# Altium schematic sheet 2 main mcu.SchDoc
size A4; DocumentNumber: 2; SheetNumber: 4; SheetTotal: 9
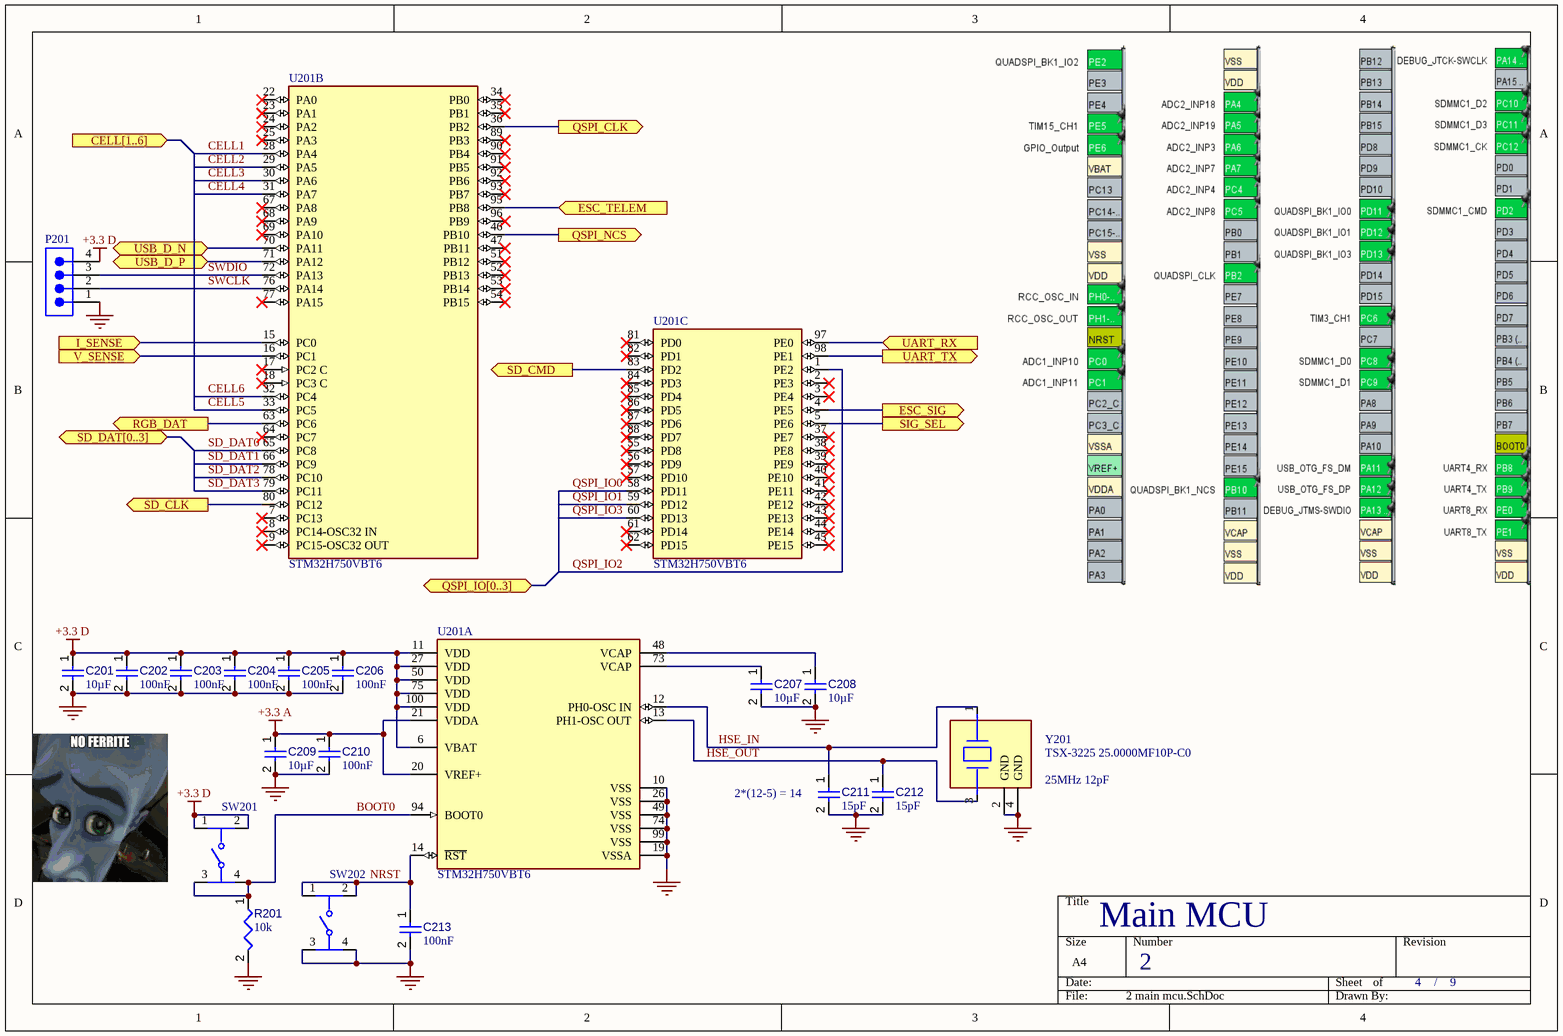
[diagram p0: 2 main mcu.SchDoc]

## Parts
C201  value 10µF  [CAPC0603(1608)100_L]  (hidden comment: Capacitor 10µF +/-20% 10V 0603)
C202  value 100nF  [CAPC0402(1005)60_L]  (hidden comment: Capacitor 100nF +/-20% 25V 0402)
C203  value 100nF  [CAPC0402(1005)60_L]  (hidden comment: Capacitor 100nF +/-20% 25V 0402)
C204  value 100nF  [CAPC0402(1005)60_L]  (hidden comment: Capacitor 100nF +/-20% 25V 0402)
C205  value 100nF  [CAPC0402(1005)60_L]  (hidden comment: Capacitor 100nF +/-20% 25V 0402)
C206  value 100nF  [CAPC0402(1005)60_L]  (hidden comment: Capacitor 100nF +/-20% 25V 0402)
C207  value 10µF  [CAPC0603(1608)100_L]  (hidden comment: Capacitor 10µF +/-20% 10V 0603)
C208  value 10µF  [CAPC0603(1608)100_L]  (hidden comment: Capacitor 10µF +/-20% 10V 0603)
C209  value 10µF  [CAPC0603(1608)100_L]  (hidden comment: Capacitor 10µF +/-20% 10V 0603)
C210  value 100nF  [CAPC0402(1005)60_L]  (hidden comment: Capacitor 100nF +/-20% 25V 0402)
C211  value 15pF  [CAPC0402(1005)60_L]  (hidden comment: Capacitor 15pF +/-20% 50V 0402)
C212  value 15pF  [CAPC0402(1005)60_L]  (hidden comment: Capacitor 15pF +/-20% 50V 0402)
C213  value 100nF  [CAPC0402(1005)60_L]  (hidden comment: Capacitor 100nF +/-20% 25V 0402)
P201  61300411121  [61300411121]  (value not drawn)
R201  value 10k  [RESC0402(1005)_L]  (hidden comment: Resistor 10K  +/-1 % 0402 63 mW)
SW201  PTS810SJM250SMTRLFS  [FP-PTS810SJM250SMTRLFS-MFG]  (value not drawn)
SW202  PTS810SJM250SMTRLFS  [FP-PTS810SJM250SMTRLFS-MFG]  (value not drawn)
U201  STM32H750VBT6  [FP-LQFP100-1L-MFG]  (parts A,B,C of 3)
Y201  TSX-3225 25.0000MF10P-C0  [FP-TSX-3225-MFG]

## Ports
CELL[1..6] (in), ESC_SIG (out), ESC_TELEM (in), I_SENSE (in), QSPI_CLK (out), QSPI_IO[0..3] (bidir), QSPI_NCS (out), RGB_DAT (out), SD_CLK (out), SD_CMD (out), SD_DAT[0..3] (bidir), SIG_SEL (out), UART_RX (in), UART_TX (out), USB_D_N (bidir), USB_D_P (bidir), V_SENSE (in)

## Nets
+3.3 A: C209.1 C210.1 U201.20(VREF+) U201.21(VDDA)
+3.3 D: C201.1 C202.1 C203.1 C204.1 C205.1 C206.1 P201.4 SW201.1 SW201.2 U201.6(VBAT) U201.11(VDD) U201.27(VDD) U201.50(VDD) U201.75(VDD) U201.100(VDD)
GND: C201.2 C202.2 C203.2 C204.2 C205.2 C206.2 C207.2 C208.2 C209.2 C210.2 C211.2 C212.2 C213.2 P201.1 R201.2 SW202.3 SW202.4 U201.10(VSS) U201.19(VSSA) U201.26(VSS) U201.49(VSS) U201.74(VSS) U201.99(VSS) Y201.2(GND) Y201.4(GND)
BOOT0: R201.1 SW201.3 SW201.4 U201.94(BOOT0)
CELL1: U201.28(PA4)
CELL2: U201.29(PA5)
CELL3: U201.30(PA6)
CELL4: U201.31(PA7)
CELL5: U201.33(PC5)
CELL6: U201.32(PC4)
ESC_SIG: U201.4(PE5) ; port ESC_SIG
ESC_TELEM: U201.95(PB8) ; port ESC_TELEM
HSE_IN: C211.1 U201.12(PH0-OSC_IN) Y201.1
HSE_OUT: C212.1 U201.13(PH1-OSC_OUT) Y201.3
I_SENSE: U201.15(PC0) ; port I_SENSE
NRST: C213.1 SW202.1 SW202.2 U201.14(~{RST})
QSPI_CLK: U201.36(PB2) ; port QSPI_CLK
QSPI_IO0: U201.58(PD11)
QSPI_IO1: U201.59(PD12)
QSPI_IO2: U201.1(PE2)
QSPI_IO3: U201.60(PD13)
QSPI_NCS: U201.46(PB10) ; port QSPI_NCS
RGB_DAT: U201.63(PC6) ; port RGB_DAT
SD_CLK: U201.80(PC12) ; port SD_CLK
SD_CMD: U201.83(PD2) ; port SD_CMD
SD_DAT0: U201.65(PC8)
SD_DAT1: U201.66(PC9)
SD_DAT2: U201.78(PC10)
SD_DAT3: U201.79(PC11)
SIG_SEL: U201.5(PE6) ; port SIG_SEL
SWCLK: P201.2 U201.76(PA14)
SWDIO: P201.3 U201.72(PA13)
UART_RX: U201.97(PE0) ; port UART_RX
UART_TX: U201.98(PE1) ; port UART_TX
USB_D_N: U201.70(PA11) ; port USB_D_N
USB_D_P: U201.71(PA12) ; port USB_D_P
V_SENSE: U201.16(PC1) ; port V_SENSE
NetC207_1: C207.1 U201.73(VCAP)
NetC208_1: C208.1 U201.48(VCAP)

Not connected (* = marked no-connect by the designer): U201 2(PE3)* 3(PE4)* 7(PC13)* 8(PC14-OSC32_IN)* 9(PC15-OSC32_OUT)* 17(PC2_C)* 18(PC3_C)* 22(PA0)* 23(PA1)* 24(PA2)* 25(PA3)* 34(PB0)* 35(PB1)* 37(PE7)* 38(PE8)* 39(PE9)* 40(PE10)* 41(PE11)* 42(PE12)* 43(PE13)* 44(PE14)* 45(PE15)* 47(PB11)* 51(PB12)* 52(PB13)* 53(PB14)* 54(PB15)* 55(PD8)* 56(PD9)* 57(PD10)* 61(PD14)* 62(PD15)* 64(PC7)* 67(PA8)* 68(PA9)* 69(PA10)* 77(PA15)* 81(PD0)* 82(PD1)* 84(PD3)* 85(PD4)* 86(PD5)* 87(PD6)* 88(PD7)* 89(PB3)* 90(PB4)* 91(PB5)* 92(PB6)* 93(PB7)* 96(PB9)*

## Notes on the sheet
- (near Y201) 25MHz 12pF
- (near C211) 2*(12-5) = 14
- Main MCU
- /

## Library data of the parts
C201 C207-C209 = CMP-001-00075-4: Chip Capacitor, 10µF +/-20%, 10V, 0603, Thickness 1 mm; Tolerance: 10%; Voltage Rating: 10V; Max Operating Temperature: 85°C; Pins: 2; Case/Package: 0603; Mounting Technology: SMT; Min Operating Temperature: -55°C
C202-C206 C210 C213 = CMP-001-00065-4: Chip Capacitor, 100nF +/-20%, 25V, 0402, Thickness 0.6 mm; Tolerance: 10%; Max Operating Temperature: 85°C; Min Operating Temperature: -55°C; Pins: 2; Voltage Rating: 25V; Mounting Technology: SMT; Case/Package: 0402
C211 C212 = CMP-001-00069-3: Chip Capacitor, 15pF +/-20%, 50V, 0402, Thickness 0.6 mm; Tolerance: 5%; Max Operating Temperature: 85°C; Pins: 2; Case/Package: 0402; Voltage Rating: 50V; Min Operating Temperature: -55°C; Mounting Technology: SMT; JLCPCB Part #: C1548
P201 = CMP-1502-01064-3: NexarPartId: 32855522; Operating Supply Voltage: 250V; Pitch: 2.54mm; Contact Resistance: 20mΩ; Number of Positions: 4; Current Rating: 3A; Connector Type: Male Pin; Gender: Male; Contact Plating: Gold; Height: 8.89mm; Lead Pitch: 2.54mm; Lead Free: Lead Free; Contact Mating Length: 5.9944mm; Number of Rows: 1; Termination: Solder; Packaging: Bulk; REACH SVHC: Unknown; Min Operating Temperature: -40°C; RoHS: Compliant; Number of Contacts: 4; Voltage Rating: 250V; Color: Black; Max Operating Temperature: 105°C; Contact Material: Copper; Mount: Through Hole; Orientation: Vertical; Number of Pins: 4
R201 = CMP-009-00149-3: Chip Resistor, 10 kOhms, +/-1 %, 63 mW, -55 to 125 degC, 0402; Power: 63mW; Tolerance: 1%; Min Operating Temperature: -55°C; Case/Package: 0402; Max Operating Temperature: 155°C; Pins: 2
SW201 SW202 = CMP-10040-000001-2: SWITCH TACTILE SPST-NO 0.05A 16V; Throw Configuration: SPST; Operating Force: 160gf; Actuator Type: Standard; Switch Travel: 0.15mm; Switch Function: Off-Mom; Max Current Rating: 50mA; Mechanical Life: 150000Cycles; Illumination Type: Non-Illuminated; Package Quantity: 2900; Depth: 4.6mm; Mount: Surface Mount; Packaging: Tape and Reel; Length: 3.2mm; RoHS Compliant: Yes; Case/Package: SMD/SMT; Voltage Rating (DC): 16V; Min Operating Temperature: -40°C; Termination: J-Bend; Lead Free: Lead Free; Contact Plating: Silver; Orientation: Straight; Max Operating Temperature: 85°C; Current Rating: 50mA; Color: Black
U201 = CMP-12105-000017-1: IC MCU 32BIT 128KB FLASH 100LQFP; Manufacturer: STMicroelectronics; Number Of Uart Channels: 9; Number Of I/Os: 82; Max Junction Temp: +125°C; Data Bus Width: 32bits; Ram Size: 1MBytes; Min Supply Voltage: 1.62V; Number Of Spi Channels: 6; Number Of Adc Channels: 36; Max Supply Voltage: 3.6V; Standoff Height: 0.05mm; Interface: I2C,SPI,UART,USART,CAN,USB,LIN,IrDA,Ethernet,I2S,Other; Number Of A/D Converters: 3; Number Of I2C Channels: 4; Memory Size: 128KBytes; Frequency: 480MHz; Number Of Timers/Counters: 20; Number Of Ethernet Channels: 1; Core Architecture: ARM Cortex-M7; Number Of Usb Channels: 2; Number Of Pwm Channels: 42; Ambient Temperature Range High: +85°C; Temperature: -40°C to +125°C; ComponentLink2URL: https://www.st.com/resource/en/datasheet/stm32h750vb.pdf; Device Class L2: Embedded Processors and Controllers; Temperature Range Low: -40°C; Octopart: https://octopart.com/stm32h750vbt6-stmicroelectronics-94048547; Category: IC; Manufacturer Part Number: STM32H750VBT6; Height: 1.6mm; Lead Free: Yes; Device Class L1: Integrated Circuits (ICs); Digikey Description: IC MCU 32BIT 128KB FLASH 100LQFP; RoHS: TRUE; Ambient Temperature Range Low: -40°C; Device Class L3: Microcontrollers; ComponentLink2Description: Datasheet; Mouser Description: MCU 32-Bit STM32H750VB ARM Cortex M7 RISC 128KB Flash 1.8V/2.5V/3.3V 100-Pin LQFP Tray; Number Of Cores: 1; Automotive: No; Memory Type: FLASH; Package: LQFP100-1L; Temperature Range High: +125°C
Y201 = CMP-36405-000019-1: CRYSTAL 25.0000MHZ 18PF SMD; ESR (Equivalent Series Resistance): 40R; Frequency Stability: 10ppm; Frequency: 25MHz; Max Operating Temperature: 85°C; Length: 3.2mm; Packaging: Tape and Reel; Min Operating Temperature: -20°C; Depth: 2.5mm; Case/Package: SMD/SMT; Load Capacitance: 18pF; Number of Pins: 4